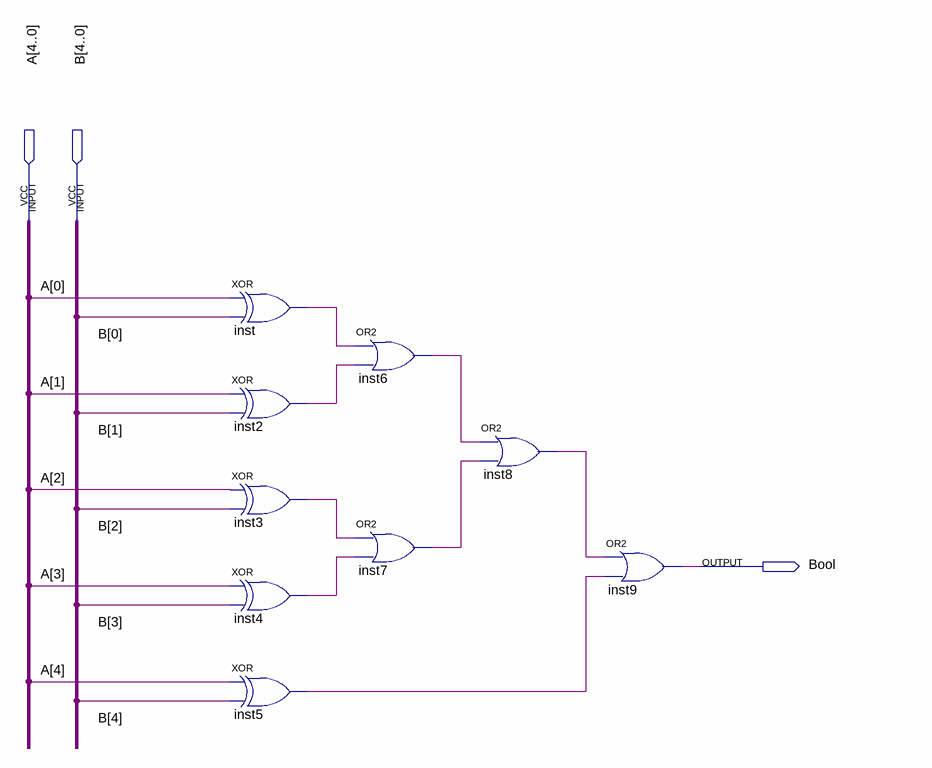
[diagram p0: schematic sheet]
// Quartus schematic Igualdade.bdf as structural Verilog: 9 symbols, 3 pins
module Igualdade (
  input  [4:0] A,
  input  [4:0] B,
  output Bool
);

  wire inst2_out, inst3_out, inst4_out, inst5_out, inst6_out, inst7_out, inst8_out, inst_out;

  xor inst (inst_out, A[0], B[0]);
  xor inst2 (inst2_out, A[1], B[1]);
  xor inst3 (inst3_out, A[2], B[2]);
  xor inst4 (inst4_out, A[3], B[3]);
  xor inst5 (inst5_out, A[4], B[4]);
  or inst6 (inst6_out, inst_out, inst2_out);
  or inst7 (inst7_out, inst3_out, inst4_out);
  or inst8 (inst8_out, inst6_out, inst7_out);
  or inst9 (Bool, inst8_out, inst5_out);
endmodule
